# Altium schematic sheet [7]_CSI.SchDoc
size A3; DocumentNumber: 7; SheetNumber: 7; SheetTotal: 9; PageSetup: Record=PageOptions|CenterHorizontal=True|CenterVertical=True|PrintScale=0.97|XCorrection=1.00|YCorrection=1.00|PrintKind=1|BorderSize=5000000|LeftOffset=0|BottomOffset=0|Orientation=2|PaperLength=2970|PaperWidth=2100|Scale=100|PaperSource=7|PrintQuality=600|MediaType=1|DitherType=10|PaperKind=A4|PrintScaleMode=1
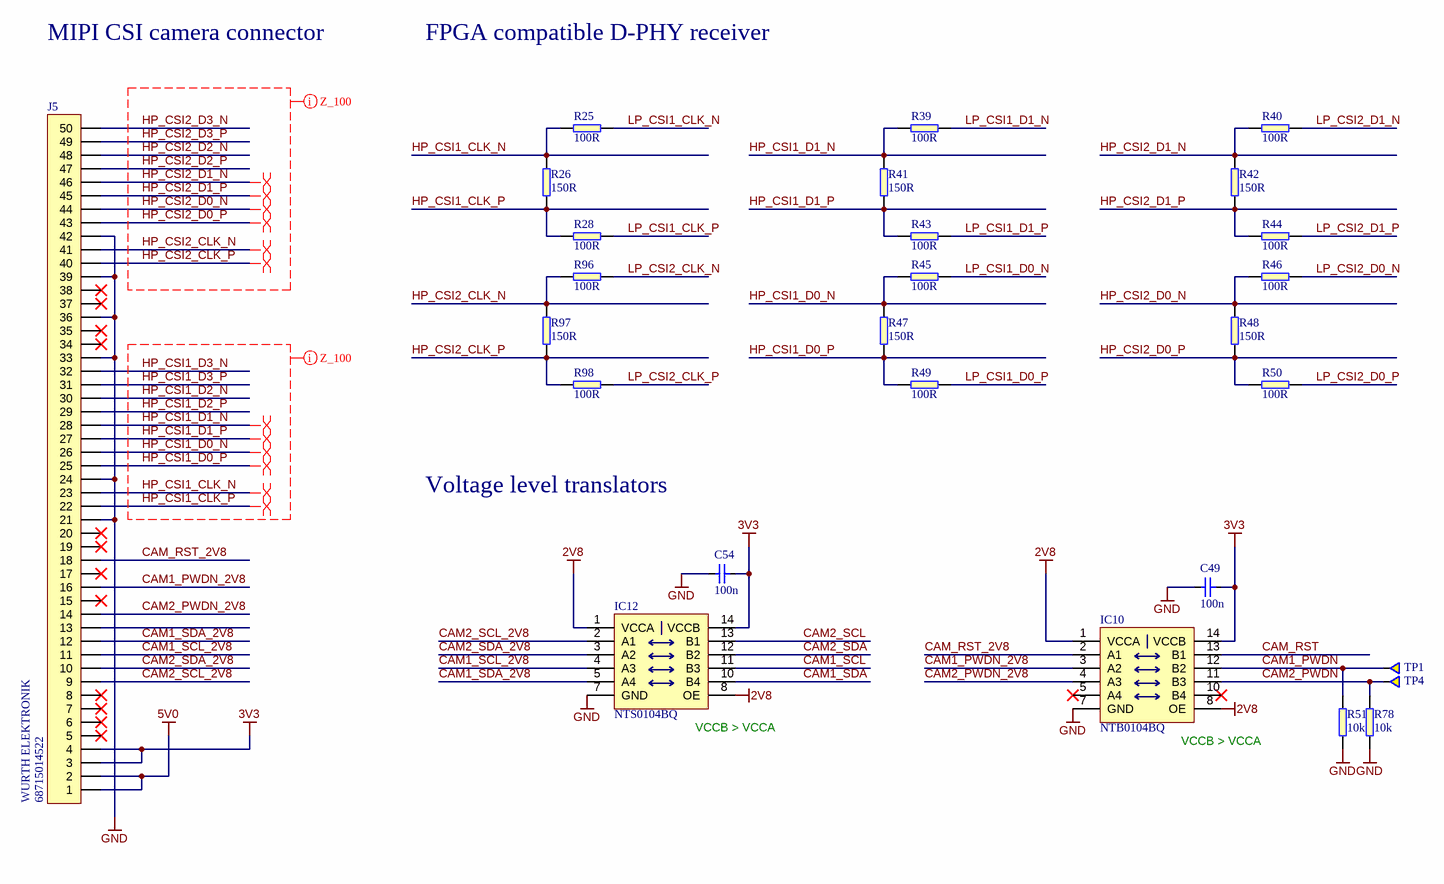
[diagram p0: [7]_CSI.SchDoc]

## Parts
C49  100n  [0402]
C54  100n  [0402]
IC10  NTB0104BQ  [DHVQFN14]
IC12  NTS0104BQ  [DHVQFN14]
J5  68715014522  Manufacturer: WURTH ELEKTRONIK  [68715014522_FLIPPED]
R25  100R  [0402]
R26  150R  [0402]
R28  100R  [0402]
R39  100R  [0402]
R40  100R  [0402]
R41  150R  [0402]
R42  150R  [0402]
R43  100R  [0402]
R44  100R  [0402]
R45  100R  [0402]
R46  100R  [0402]
R47  150R  [0402]
R48  150R  [0402]
R49  100R  [0402]
R50  100R  [0402]
R51  10k  [0402]
R78  10k  [0402]
R96  100R  [0402]
R97  150R  [0402]
R98  100R  [0402]
TP1  Testpad  [TP-R-2]  (value not drawn)  (no BOM)
TP4  Testpad  [TP-R-2]  (value not drawn)  (no BOM)

## Nets
2V8: IC10.1(VCCA) IC10.8(OE) IC12.1(VCCA) IC12.8(OE)
3V3: C49.1 C54.1 IC10.14(VCCB) IC12.14(VCCB) J5.3 J5.4
5V0: J5.1 J5.2
GND: C49.2 C54.2 IC10.7(GND) IC12.7(GND) J5.21 J5.24 J5.33 J5.36 J5.39 J5.42 R51.1 R78.1
CAM1_PWDN: IC10.12(B2) R51.2 TP1.1
CAM1_PWDN_2V8: IC10.3(A2) J5.16
CAM1_SCL: IC12.11(B3)
CAM1_SCL_2V8: IC12.4(A3) J5.11
CAM1_SDA: IC12.10(B4)
CAM1_SDA_2V8: IC12.5(A4) J5.12
CAM2_PWDN: IC10.11(B3) R78.2 TP4.1
CAM2_PWDN_2V8: IC10.4(A3) J5.14
CAM2_SCL: IC12.13(B1)
CAM2_SCL_2V8: IC12.2(A1) J5.9
CAM2_SDA: IC12.12(B2)
CAM2_SDA_2V8: IC12.3(A2) J5.10
CAM_RST: IC10.13(B1)
CAM_RST_2V8: IC10.2(A1) J5.18
HP_CSI1_CLK_N: J5.23 R25.1 R26.2
HP_CSI1_CLK_P: J5.22 R26.1 R28.1
HP_CSI1_D0_N: J5.26 R45.1 R47.2
HP_CSI1_D0_P: J5.25 R47.1 R49.1
HP_CSI1_D1_N: J5.28 R39.1 R41.2
HP_CSI1_D1_P: J5.27 R41.1 R43.1
HP_CSI1_D2_N: J5.30
HP_CSI1_D2_P: J5.29
HP_CSI1_D3_N: J5.32
HP_CSI1_D3_P: J5.31
HP_CSI2_CLK_N: J5.41 R96.1 R97.2
HP_CSI2_CLK_P: J5.40 R97.1 R98.1
HP_CSI2_D0_N: J5.44 R46.1 R48.2
HP_CSI2_D0_P: J5.43 R48.1 R50.1
HP_CSI2_D1_N: J5.46 R40.1 R42.2
HP_CSI2_D1_P: J5.45 R42.1 R44.1
HP_CSI2_D2_N: J5.48
HP_CSI2_D2_P: J5.47
HP_CSI2_D3_N: J5.50
HP_CSI2_D3_P: J5.49
LP_CSI1_CLK_N: R25.2
LP_CSI1_CLK_P: R28.2
LP_CSI1_D0_N: R45.2
LP_CSI1_D0_P: R49.2
LP_CSI1_D1_N: R39.2
LP_CSI1_D1_P: R43.2
LP_CSI2_CLK_N: R96.2
LP_CSI2_CLK_P: R98.2
LP_CSI2_D0_N: R46.2
LP_CSI2_D0_P: R50.2
LP_CSI2_D1_N: R40.2
LP_CSI2_D1_P: R44.2

Not connected (* = marked no-connect by the designer): IC10 5(A4)* 10(B4)*; J5 5* 6* 7* 8* 13 15* 17* 19* 20* 34* 35* 37* 38*

## Layout directives
differential pair: HP_CSI1_CLK_N, HP_CSI1_CLK_P, HP_CSI1_D0_N, HP_CSI1_D0_P, HP_CSI1_D1_N, HP_CSI1_D1_P, HP_CSI2_CLK_N, HP_CSI2_CLK_P, HP_CSI2_D0_N, HP_CSI2_D0_P, HP_CSI2_D1_N, HP_CSI2_D1_P
Z_100: 100: HP_CSI1_CLK_N, HP_CSI1_CLK_P, HP_CSI1_D0_N, HP_CSI1_D0_P, HP_CSI1_D1_N, HP_CSI1_D1_P, HP_CSI1_D2_N, HP_CSI1_D2_P, HP_CSI1_D3_N, HP_CSI1_D3_P, HP_CSI2_CLK_N, HP_CSI2_CLK_P, HP_CSI2_D0_N, HP_CSI2_D0_P, HP_CSI2_D1_N, HP_CSI2_D1_P, HP_CSI2_D2_N, HP_CSI2_D2_P, HP_CSI2_D3_N, HP_CSI2_D3_P

## Notes on the sheet
- MIPI CSI camera connector
- FPGA compatible D-PHY receiver
- Voltage level translators
- (near IC12) VCCB > VCCA
- (near IC10) VCCB > VCCA
- Title:
- Size:
- Date:
- A3
- Revision:
- Page:
- of
- Antmicro Ltd.
- File:
- www.antmicro.com

## Library data of the parts
C49 C54 = C_100n_0402: MLCC SMT Capacitor 100nF 0402; Manufacturer: MULTICOMP; Part Symbol: MC0402X104M100CT; Voltage: 10V; Tolerance: +-20%; Part Number: C_100n_0402; Value: 100n
IC10 = NTB0104BQ: 4 bit voltage level translator - no pullups; Manufacturer: NXP; Part Number: NTB0104BQ; Value: NTB0104BQ; Part Symbol: NTB0104BQ
IC12 = NTS0104BQ: 4 bit voltage level translator - pullups; Manufacturer: NXP; Value: NTS0104BQ; Part Number: NTS0104BQ; Part Symbol: NTS0104BQ
J5 = 1X50: 0.50mm SMT ZIF Horizontal Bottom Contact WR-FPC; Part Number: WE-687-150-145-22_FLIPPED; Value: 68715014522; Part Symbol: 68715014522
R25 R28 R39 R40 R43-R46 R49 R50 R96 R98 = R_100R_0402: SMT Resistor 100R 0402; Manufacturer: BOURNS; Part Symbol: CR0402-FX-1000GLF; Tolerance: 1%; Part Number: R_100R_0402; Value: 100R
R26 R41 R42 R47 R48 R97 = R_150R_0402: SMT Resistor 150R_0402; Manufacturer: VISHAY; Part Symbol: CRCW0402150RFKED; Tolerance: 1%; Part Number: R_150R_0402; Value: 150R
R51 R78 = R_10k_0402: SMT Resistor 10k 0402; Manufacturer: MULTICOMP; Part Symbol: MCMR04X1002FTL; Tolerance: 1%; Part Number: R_10k_0402; Value: 10k
TP1 TP4 = Testpad: Testpad, round, 2mm; Part Number: TP-R-2